# EAGLE schematic wordclock-satellite-led-r1 (EAGLE 5.11)
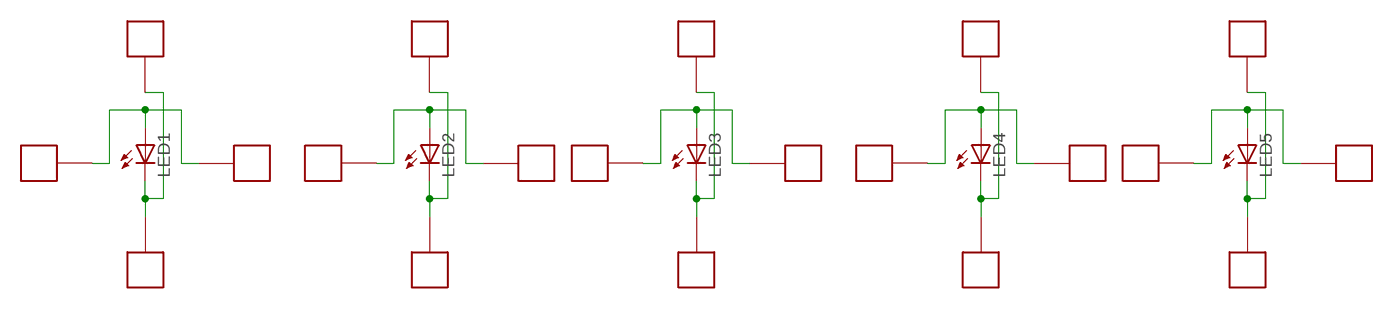
[diagram p0: schematic, sheet 1]

## Parts
LED1  LEDKA-3528ASYC  [KA-3528ASYC]
LED2  LEDKA-3528ASYC  [KA-3528ASYC]
LED3  LEDKA-3528ASYC  [KA-3528ASYC]
LED4  LEDKA-3528ASYC  [KA-3528ASYC]
LED5  LEDKA-3528ASYC  [KA-3528ASYC]
X1  PAD-1.5X4  [PAD-1.5X4]
X2  PAD-2X4  [PAD-2X4]
X3  PAD-2X4  [PAD-2X4]
X4  PAD-2X4  [PAD-2X4]
X5  PAD-2X4  [PAD-2X4]
X6  PAD-2X4  [PAD-2X4]
X7  PAD-2X4  [PAD-2X4]
X8  PAD-2X4  [PAD-2X4]
X9  PAD-2X4  [PAD-2X4]
X10  PAD-2X4  [PAD-2X4]
X11  PAD-2X4  [PAD-2X4]
X12  PAD-2X4  [PAD-2X4]
X13  PAD-2X4  [PAD-2X4]
X14  PAD-2X4  [PAD-2X4]
X15  PAD-2X4  [PAD-2X4]
X16  PAD-2X4  [PAD-2X4]
X17  PAD-2X4  [PAD-2X4]
X18  PAD-1.5X4  [PAD-1.5X4]
X19  PAD-2X4  [PAD-2X4]
X20  PAD-2X4  [PAD-2X4]

## Nets
K1: LED1.C X3.P$1 X4.P$1
K2: LED2.C X7.P$1 X8.P$1
K3: LED3.C X11.P$1 X12.P$1
K4: LED4.C X15.P$1 X16.P$1
K5: LED5.C X19.P$1 X20.P$1
N$1: LED1.A X1.P$1 X2.P$1
N$2: LED2.A X5.P$1 X6.P$1
N$3: LED3.A X9.P$1 X10.P$1
N$4: LED4.A X13.P$1 X14.P$1
N$5: LED5.A X17.P$1 X18.P$1

## Library data of the parts
LED1-LED5 = led:LED: LED OSRAM: - CHIPLED LG R971, LG N971, LY N971, LG Q971, LY Q971, LO R971, LY R971 LH N974, LH R974 LS Q976, LO Q976, LY Q976 LO Q996 - Hyper CHIPLED LW Q18S LB Q993, LB Q99A, LB R99A - SideLED LS A670, LO A670, LY A670, LG A670, LP A670 LB A673, LV A673, LT A673, LW A673 LH A674 LY A675 LS A676, LA A676, LO A676, LY A676, LW A676 LS A679, LY A679, LG A679 - Hyper Micro SIDELED® LS Y876, LA Y876, LO Y876, LY Y876 LT Y87S - SmartLED LW L88C, LW L88S LB L89C, LB L89S, LG L890 LS L89K, LO L89K, LY L89K LS L896, LA L896, LO L896, LY L896 - TOPLED LS T670, LO T670, LY T670, LG T670, LP T670 LSG T670, LSP T670, LSY T670, LOP T670, LYG T670 LG T671, LOG T671, LSG T671 LB T673, LV T673, LT T673, LW T673 LH T674 LS T676, LA T676, LO T676, LY T676, LB T676, LH T676, LSB T676, LW T676 LB T67C, LV T67C, LT T67C, LS T67K, LO T67K, LY T67K, LW E67C LS E67B, LA E67B, LO E67B, LY E67B, LB E67C, LV E67C, LT E67C LW T67C LS T679, LY T679, LG T679 LS T770, LO T770, LY T770, LG T770, LP T770 LB T773, LV T773, LT T773, LW T773 LH T774 LS E675, LA E675, LY E675, LS T675 LS T776, LA T776, LO T776, LY T776, LB T776 LHGB T686 LT T68C, LB T68C - Hyper Mini TOPLED® LB M676 - Mini TOPLED Santana® LG M470 LS M47K, LO M47K, LY M47K Source: http://www.osram.convergy.de LUXEON: - LUMILED® LXK2-PW12-R00, LXK2-PW12-S00, LXK2-PW14-U00, LXK2-PW14-V00 LXK2-PM12-R00, LXK2-PM12-S00, LXK2-PM14-U00 LXK2-PE12-Q00, LXK2-PE12-R00, LXK2-PE12-S00, LXK2-PE14-T00, LXK2-PE14-U00 LXK2-PB12-K00, LXK2-PB12-L00, LXK2-PB12-M00, LXK2-PB14-N00, LXK2-PB14-P00, LXK2-PB14-Q00 LXK2-PR12-L00, LXK2-PR12-M00, LXK2-PR14-Q00, LXK2-PR14-R00 LXK2-PD12-Q00, LXK2-PD12-R00, LXK2-PD12-S00 LXK2-PH12-R00, LXK2-PH12-S00 LXK2-PL12-P00, LXK2-PL12-Q00, LXK2-PL12-R00 Source: www.luxeon.com KINGBRIGHT: KA-3528ASYC Source: www.kingbright.com
X1-X20 = rbg-generic-pads:PAD